# Altium schematic sheet Top Level_V2.SchDoc: Top Level Schematic
size A3; SheetNumber: 1; SheetTotal: 6
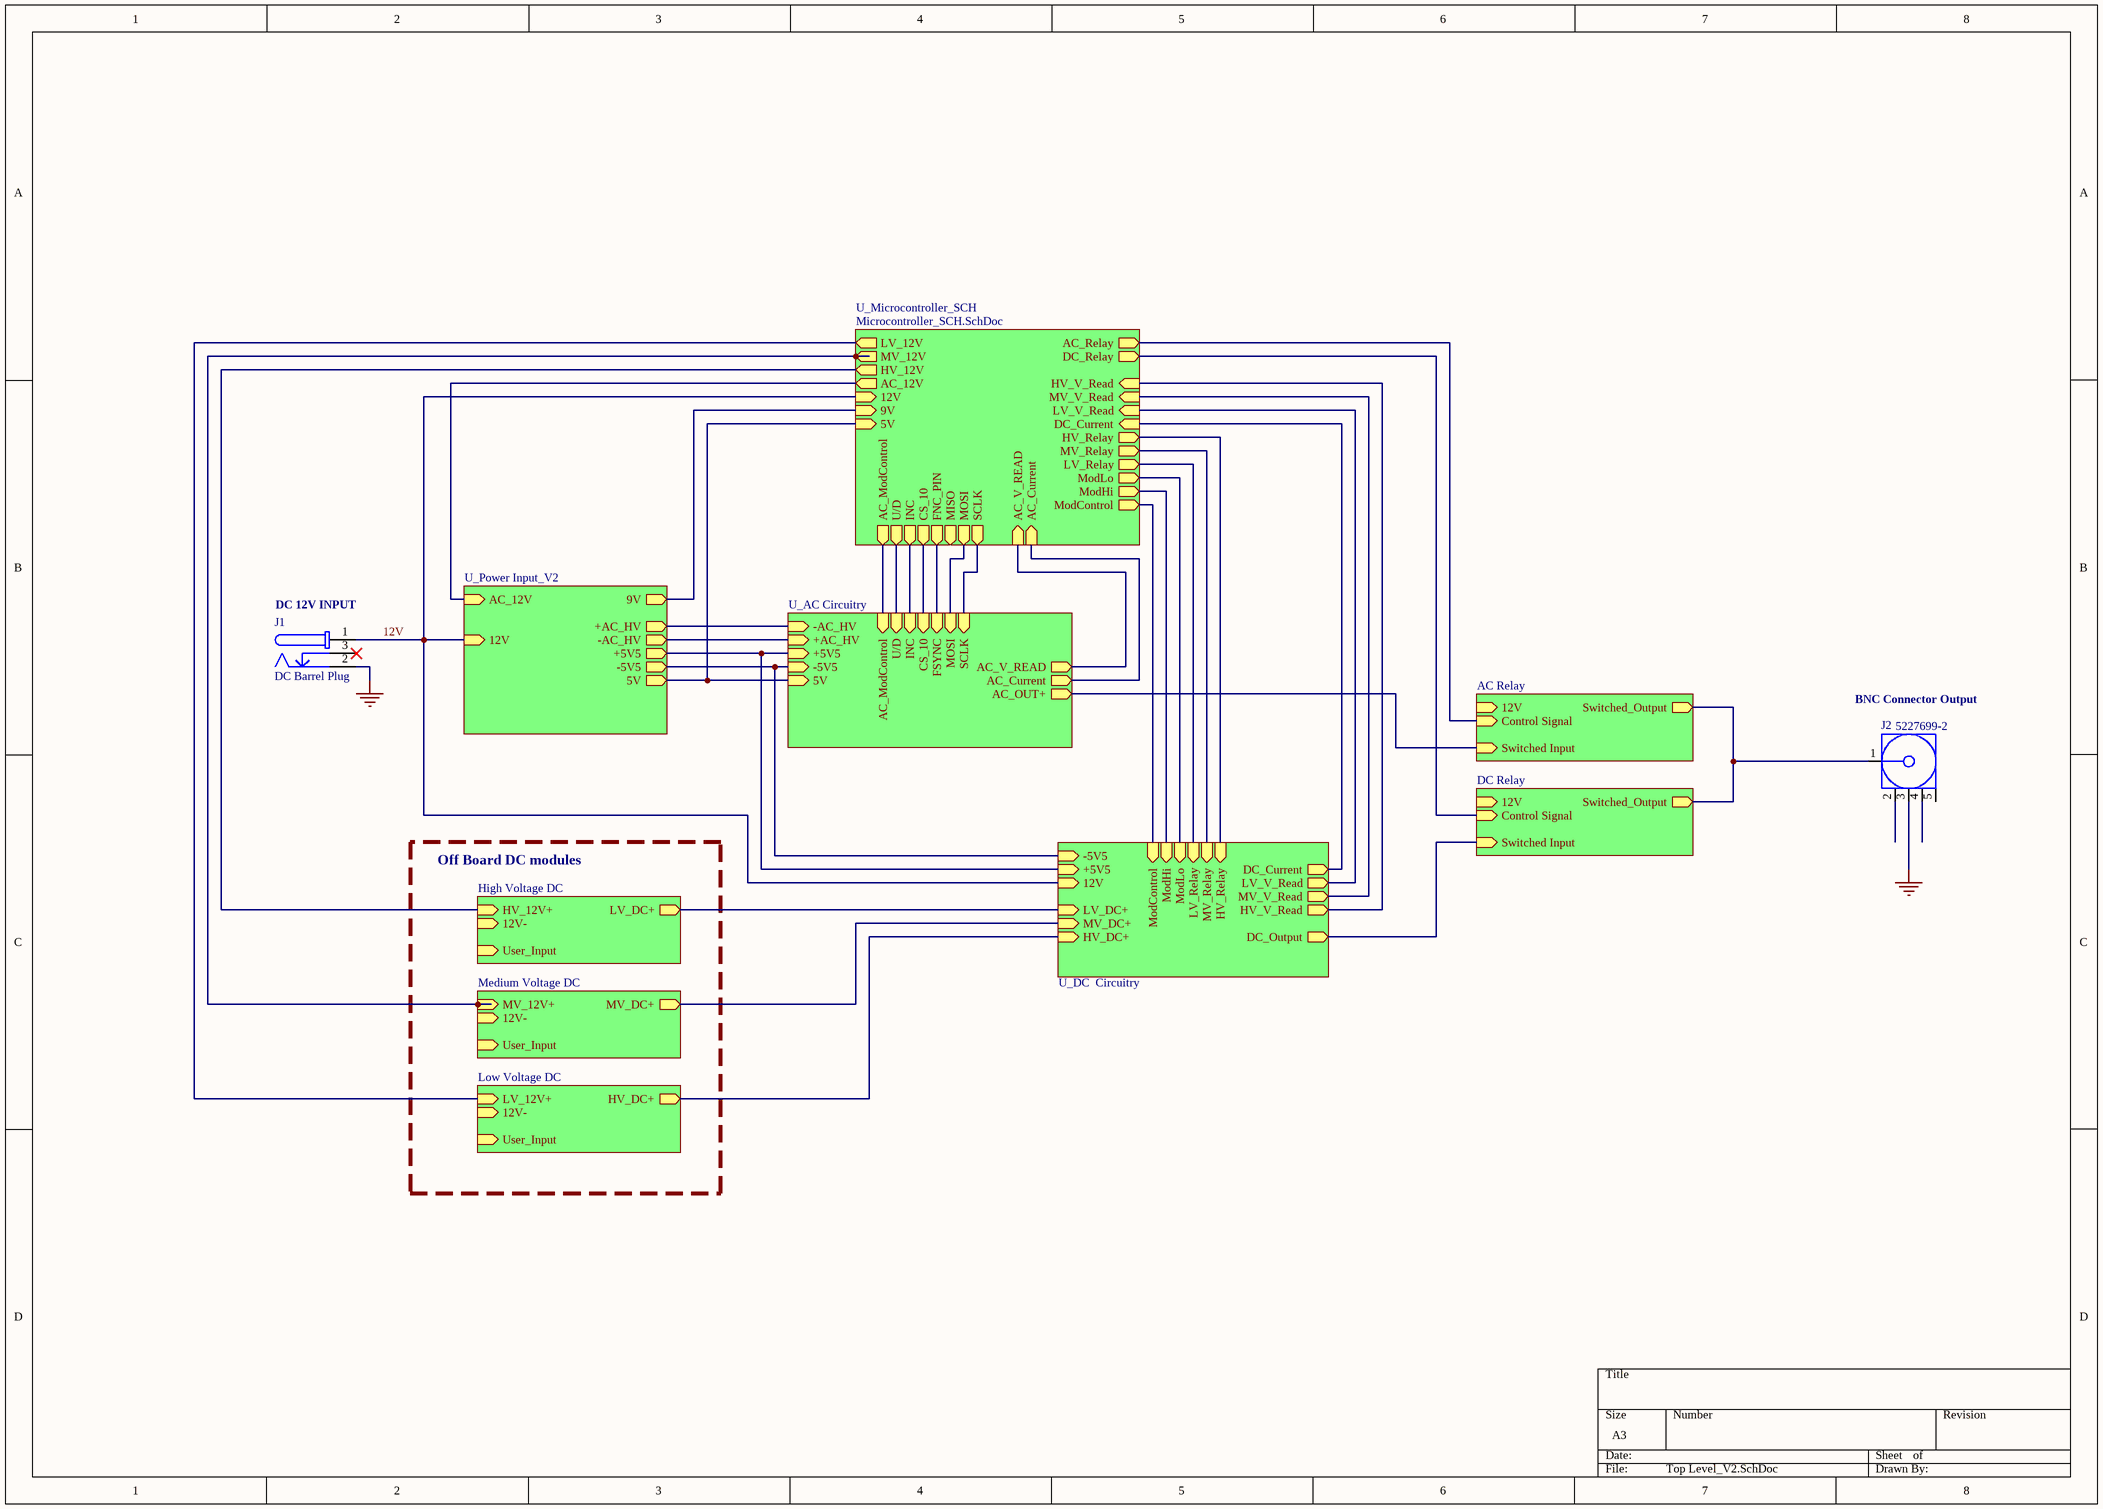
[diagram p0: Top Level_V2.SchDoc]

## Parts
J1  DC Barrel Plug  [694108106102]
J2  5227699-2  [TECO-5227699-2_V]

## Sub-sheets
AC Relay = Relay Control.SchDoc: 12V (in), Switched_Output (out), Switched Input (in), Control Signal (in)
DC Relay = Relay Control.SchDoc: 12V (in), Switched_Output (out), Switched Input (in), Control Signal (in)
High Voltage DC = File Name: HV_12V+ (in), 12V- (in), User_Input (in), LV_DC+ (out)
Low Voltage DC = File Name: LV_12V+ (in), 12V- (in), User_Input (in), HV_DC+ (out)
Medium Voltage DC = File Name: MV_12V+ (in), 12V- (in), User_Input (in), MV_DC+ (out)
U_AC Circuitry = AC Circuitry.SchDoc: -AC_HV (in), +AC_HV (in), AC_OUT+ (out), AC_V_READ (out), +5V5 (in), -5V5 (in), 5V (in), MOSI (in), SCLK (in), FSYNC (in), AC_Current (out), CS_10 (in), INC (in), U/D (in), AC_ModControl (in)
U_DC  Circuitry = DC Measurement &Modulation.SchDoc: LV_DC+ (in), MV_DC+ (in), HV_DC+ (in), MV_V_Read (out), LV_V_Read (out), HV_V_Read (out), +5V5 (in), -5V5 (in), ModControl (in), DC_Current (out), DC_Output (out), 12V (in), ModHi (in), ModLo (in), LV_Relay (in), MV_Relay (in), HV_Relay (in)
U_Microcontroller_SCH = Microcontroller_SCH.SchDoc: 9V (in), AC_V_READ (in), LV_V_Read (in), MV_V_Read (in), HV_V_Read (in), ModControl (out), AC_Relay (out), DC_Current (in), AC_Current (in), DC_Relay (out), FNC_PIN (out), LV_Relay (out), MV_Relay (out), HV_Relay (out), ModLo (out), ModHi (out), CS_10 (out), AC_ModControl (out), INC (out), U/D (out), 12V (in), LV_12V (out), MV_12V (out), HV_12V (out), AC_12V (out), MISO (out), MOSI (out), SCLK (out), 5V (in)
U_Power Input_V2 = Power Input_V2.SchDoc: -5V5 (out), +5V5 (out), 5V (out), 9V (out), AC_12V (in), -AC_HV (out), +AC_HV (out), 12V (in)

## Nets
GND: J1.2 J2.3
12V: J1.1 ; sheet U_Microcontroller_SCH/12V, sheet U_Power Input_V2/12V, sheet U_DC  Circuitry/12V
NetJ2_1: J2.1 ; sheet AC Relay/Switched_Output, sheet DC Relay/Switched_Output
(unnamed): sheet U_Microcontroller_SCH/9V, sheet U_Power Input_V2/9V
(unnamed): sheet U_Microcontroller_SCH/AC_V_READ, sheet U_AC Circuitry/AC_V_READ
(unnamed): sheet U_Microcontroller_SCH/LV_V_Read, sheet U_DC  Circuitry/LV_V_Read
(unnamed): sheet U_Microcontroller_SCH/MV_V_Read, sheet U_DC  Circuitry/MV_V_Read
(unnamed): sheet U_Microcontroller_SCH/HV_V_Read, sheet U_DC  Circuitry/HV_V_Read
(unnamed): sheet U_Microcontroller_SCH/ModControl, sheet U_DC  Circuitry/ModControl
(unnamed): sheet U_Microcontroller_SCH/AC_Relay, sheet AC Relay/Control Signal
(unnamed): sheet U_Microcontroller_SCH/DC_Current, sheet U_DC  Circuitry/DC_Current
(unnamed): sheet U_Microcontroller_SCH/AC_Current, sheet U_AC Circuitry/AC_Current
(unnamed): sheet U_Microcontroller_SCH/DC_Relay, sheet DC Relay/Control Signal
(unnamed): sheet U_Microcontroller_SCH/FNC_PIN, sheet U_AC Circuitry/FSYNC
(unnamed): sheet U_Microcontroller_SCH/LV_Relay, sheet U_DC  Circuitry/LV_Relay
(unnamed): sheet U_Microcontroller_SCH/MV_Relay, sheet U_DC  Circuitry/MV_Relay
(unnamed): sheet U_Microcontroller_SCH/HV_Relay, sheet U_DC  Circuitry/HV_Relay
(unnamed): sheet U_Microcontroller_SCH/ModLo, sheet U_DC  Circuitry/ModLo
(unnamed): sheet U_Microcontroller_SCH/ModHi, sheet U_DC  Circuitry/ModHi
(unnamed): sheet U_Microcontroller_SCH/CS_10, sheet U_AC Circuitry/CS_10
(unnamed): sheet U_Microcontroller_SCH/AC_ModControl, sheet U_AC Circuitry/AC_ModControl
(unnamed): sheet U_Microcontroller_SCH/INC, sheet U_AC Circuitry/INC
(unnamed): sheet U_Microcontroller_SCH/U/D, sheet U_AC Circuitry/U/D
(unnamed): sheet U_Microcontroller_SCH/LV_12V, sheet Low Voltage DC/LV_12V+
(unnamed): sheet U_Microcontroller_SCH/MV_12V, sheet Medium Voltage DC/MV_12V+
(unnamed): sheet U_Microcontroller_SCH/HV_12V, sheet High Voltage DC/HV_12V+
(unnamed): sheet U_Microcontroller_SCH/AC_12V, sheet U_Power Input_V2/AC_12V
(unnamed): sheet U_Microcontroller_SCH/MOSI, sheet U_AC Circuitry/MOSI
(unnamed): sheet U_Microcontroller_SCH/SCLK, sheet U_AC Circuitry/SCLK
(unnamed): sheet U_Microcontroller_SCH/5V, sheet U_Power Input_V2/5V, sheet U_AC Circuitry/5V
(unnamed): sheet Low Voltage DC/HV_DC+, sheet U_DC  Circuitry/HV_DC+
(unnamed): sheet High Voltage DC/LV_DC+, sheet U_DC  Circuitry/LV_DC+
(unnamed): sheet Medium Voltage DC/MV_DC+, sheet U_DC  Circuitry/MV_DC+
(unnamed): sheet U_Power Input_V2/-5V5, sheet U_DC  Circuitry/-5V5, sheet U_AC Circuitry/-5V5
(unnamed): sheet U_Power Input_V2/+5V5, sheet U_DC  Circuitry/+5V5, sheet U_AC Circuitry/+5V5
(unnamed): sheet U_Power Input_V2/-AC_HV, sheet U_AC Circuitry/+AC_HV
(unnamed): sheet U_Power Input_V2/+AC_HV, sheet U_AC Circuitry/-AC_HV
(unnamed): sheet U_DC  Circuitry/DC_Output, sheet DC Relay/Switched Input
(unnamed): sheet AC Relay/Switched Input, sheet U_AC Circuitry/AC_OUT+

Not connected (* = marked no-connect by the designer): J1 3*; J2 2 4 5

## Notes on the sheet
- (near J1) DC 12V INPUT
- BNC Connector Output
- Off Board DC modules

## Library data of the parts
J1 = CMP-015-00011-1: 24V, 5A, 2.5mm Dia, surface mounted; Connector Type: Circular,Power; Mounting Technology: Board; RoHS Compliant: Yes
J2 = CMP-002-00079-1: RF BNC Connector, 1 Contact(s), Female, Board Mount, Solder Terminal, Locking, Jack; Min Operating Temperature: -55°C; Max Operating Temperature: 85°C; Mounting Technology: Board; RoHS Compliant: Yes; Connector Type: BNC